# EAGLE design NwazetPowerSwitchModule (EAGLE 6.1)
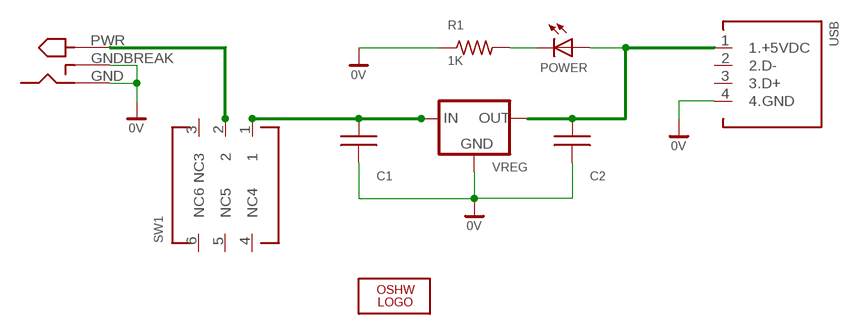
[diagram p0: schematic, sheet 1]

## Parts
C1  0.47uF  CAP_CER_2.2UF_0805  [0805]
C2  MURATA_GRM_10UF_CER_0805  [0805]
LOGO1  OSHW_LOGO_FILLX0100-NT  [OSHW_FILLX100_NOTEXT]
PJ  CUI_POWER_JACK_102A  [CUI_PJ-102A]
POWER  LITEON_WHITE_LED_0805  [0805]
R1  1K  RESISTOR_0805  [0805]
SW1  CTS_065T_SPST_SLIDE_SWITCH  [CTS_065T_SPST_SLIDE_SWITCH]
USB  AMPHENOL_USB_TYPE_A_FEMALE_CONNECTOR  [USB_CONNECTOR_TYPE_A_FEMALE]
VREG  ON_MC33269_800MA_VREG  [800MA_VREG_DPAK]

## Nets
+5VDC: C2.K POWER.A USB.1(1.+5VDC) VREG.2.VOUT(OUT)
GND: C1.A C2.A PJ.GND PJ.GNDBREAK R1.A USB.4(4.GND) VREG.1.GND_ADJ(GND) ; supply symbol labelled 0V
N$3: POWER.K(C) R1.K
PWR: PJ.PWR SW1.2
PWR_ON: C1.K SW1.1 VREG.3.VIN(IN)
Unconnected: SW1.3(NC3) SW1.4(NC4) SW1.5(NC5) SW1.6(NC6) USB.2(2.D-) USB.3(3.D+)

## Library data of the parts
C1 = Nwazet.Go:CAP_CER_2.2UF_0805
C2 = Nwazet.Go:MURATA_GRM_10UF_CER_0805
LOGO1 = ohw-logo:OSHW_LOGO_FILL
PJ = Nwazet.Go:CUI_POWER_JACK_102A
POWER = Nwazet.Go:LITEON_WHITE_LED_0805
R1 = Nwazet.Go:RESISTOR_0805
SW1 = Nwazet.Go:CTS_065T_SPST_SLIDE_SWITCH
USB = Nwazet.Go:AMPHENOL_USB_TYPE_A_FEMALE_CONNECTOR
VREG = Nwazet.Go:ON_MC33269_800MA_VREG

## Board
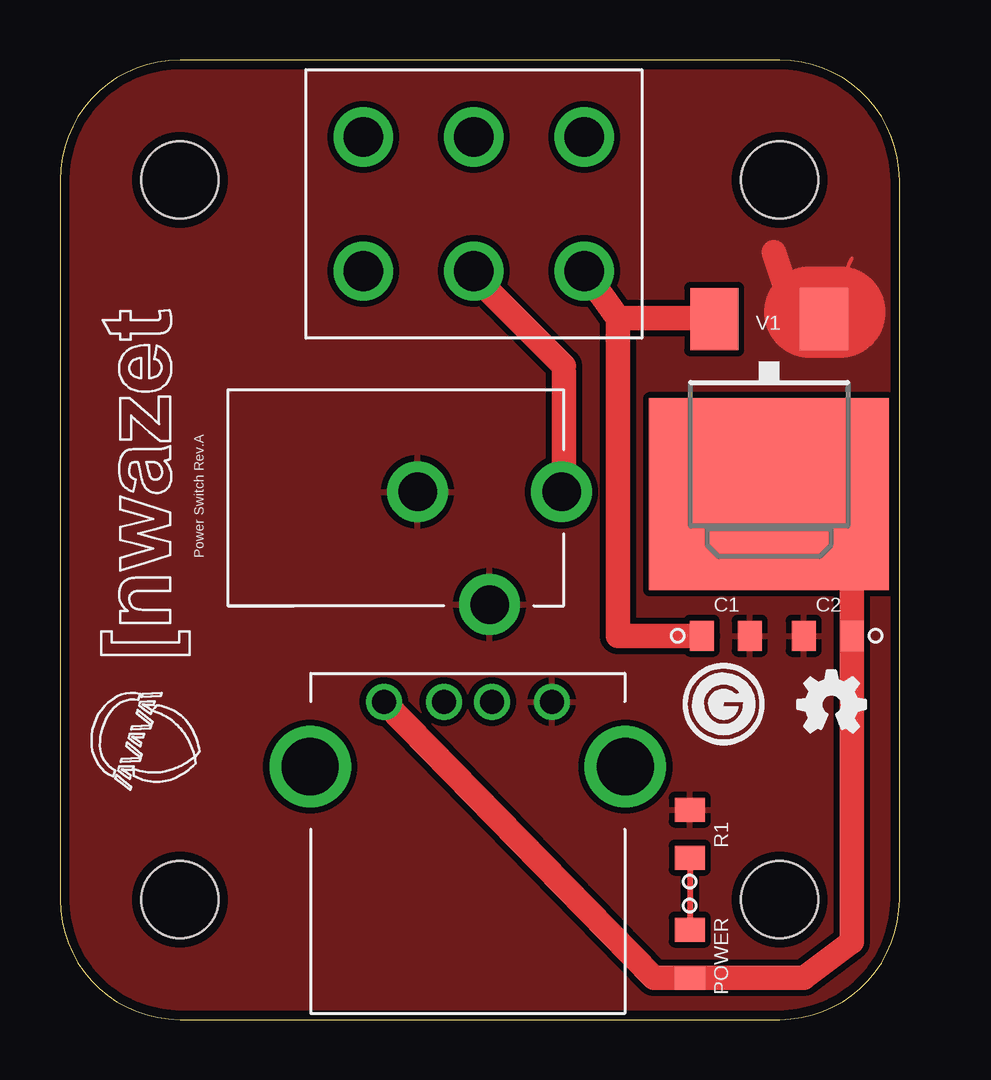
[diagram p1: board, top side]
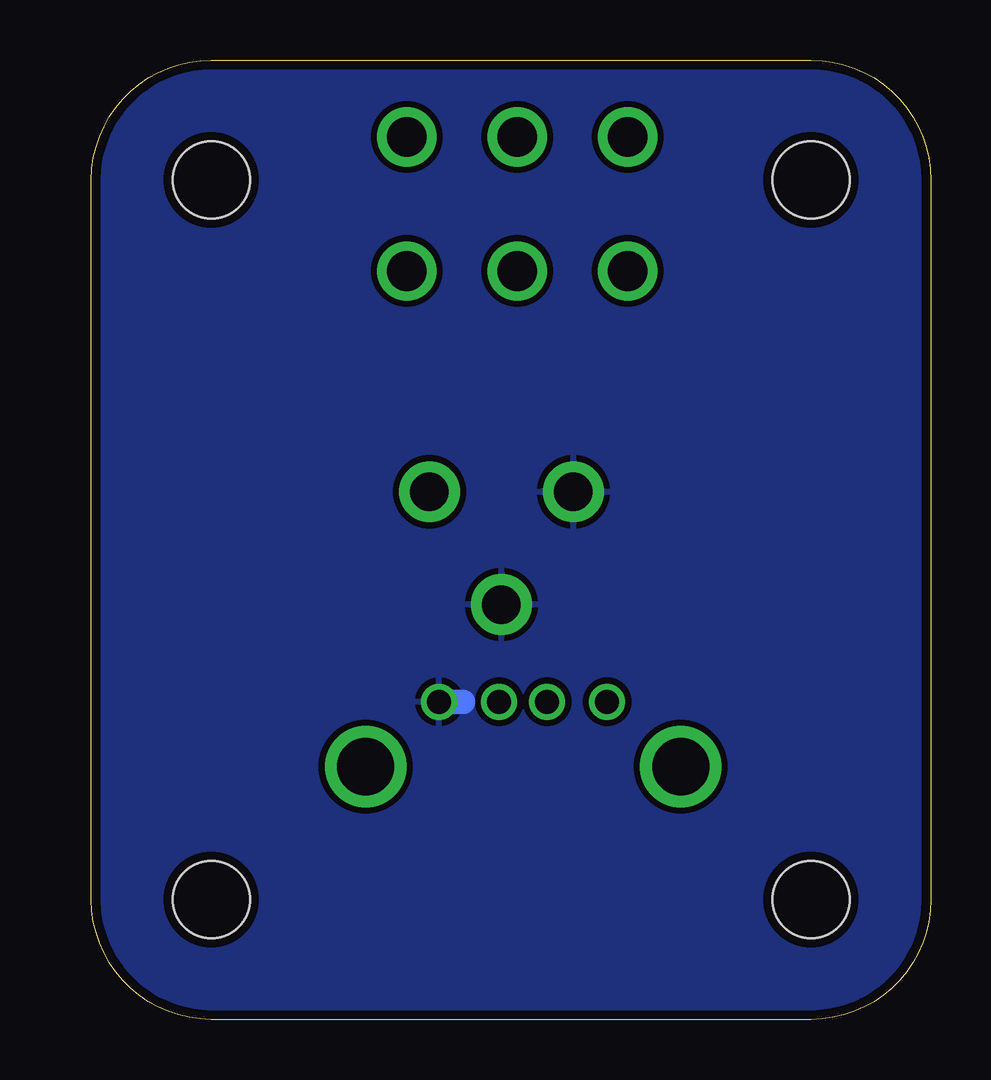
[diagram p2: board, bottom side, seen from below]

Size 35 x 40 mm. Coordinates in mm from the lower left corner, seen from the top.
Outline: 5,0 30,0 arc90 35,5 35,35 arc90 30,40 5,40 arc90 0,35 0,5 arc90 5,0
Copper layers (1*16): Top 0.0356mm / dielectric 1.5011mm / Bottom 0.0356mm
Design rules: minimum track width 6mil, minimum drill 13mil, track to track 6mil, track to pad 6mil, pad to pad 6mil, via to via 6mil, smd to smd 6mil, copper to edge 15mil, drill to drill 6mil, minimum pad ring 7mil, minimum via ring 7mil, stop-mask expansion 4mil, vias tented up to drill 0mil, thermal gap 10mil
Holes 3.2 mm at 5,35 5,5 30,5 30,35

### Footprints (pad centres in the part's own frame; a part is rotated, then mirrored left to right if it is on the bottom)
0805 = smd 1.25 x 1: A 0,1; K 0,-1
CUI_PJ-102A = drill 1.6 pad 2.54: GND 0,3.09; GNDBREAK -4.7,0.09; PWR 0,-2.91
CTS_065T_SPST_SLIDE_SWITCH = drill 1.65: 1 4.6,-2.8; 2 0,-2.8; 3 -4.6,-2.8; 4 4.6,2.8; 5 0,2.8; 6 -4.6,2.8
USB_CONNECTOR_TYPE_A_FEMALE = drill 1: 1 -3.5,0; 2 -1,0; 3 1,0; 4 3.5,0 | drill 2.38: P$1 -6.57,-2.71; P$2 6.57,-2.71
800MA_VREG_DPAK = smd 2 x 2.6: 1.GND_ADJ -2.28,-6.07; 3.VIN 2.28,-6.07 | smd 10 x 8: 2.VOUT 0,1.23

### Placement (x,y rotation side)
C1  27.75,16 270 top
C2  32,16 90 top
LOGO1  30.75,12 0 top
PJ  18,22 90 top
POWER  26.25,2.75 180 top
R1  26.25,7.75 0 top
SW1  17.25,34 0 top
U$1  [GO_LOGO]  27.75,13 0 top
USB  17,13.25 0 top
VREG  29.56,23.13 180 top

### Tracks (layer width: path | path; a pad name or v marks a point on that pad's centre or on a via)
+5VDC
  Top 0.152: 33,20.5 VREG.2.VOUT 33,20.5 | 33,16.25 C2.K 33,16.25
  Top 0.254: 33,20.5 30.25,23 VREG.2.VOUT | C2.K 33,16.25
  Top 1.016: C2.K 33,3.25 31,1.75 29.75,1.75 POWER.A 24.75,1.75 USB.1 | 33,16.25 33,20.5
GND
  Top 0.152: 33,31.75 VREG.1.GND_ADJ
  Top 0.254: 32,31 VREG.1.GND_ADJ
  Top 1.016: 31.25,29.5 30.25,30.5 29.75,32
  Top 3.81: 31.25,29.5 32.5,29.5
  Bottom 1.016: USB.4 19.5,13.25
  pour Bottom (isolate 0.254): 35,35 35,5 arc-90 30,0 5,0 arc-90 0,5 0,35 arc-90 5,40 30,40 arc-90
  pour Top (isolate 0.254): 35,35 35,5 arc-90 30,0 5,0 arc-90 0,5 0,35 arc-90 5,40 30,40 arc-90
N$3
  Top 0.254: R1.K POWER.K
PWR
  Top 0.152: 21,22 PJ.PWR | 21,27 21,27.25 | 17.25,31 SW1.2
  Top 1.016: 21,22 21,26.5 21,27 | 21,27.25 17.25,31
PWR_ON
  Top 0.152: 27.25,29.25 VREG.3.VIN | 22,31 SW1.1
  Top 1.016: C1.K 23.25,16 23.25,25.75 23.25,29.25 | 27.25,29.25 23.25,29.25 | 23.25,29.25 22,31

### Text on the board
tPlace: V1 | Power Switch Rev.A